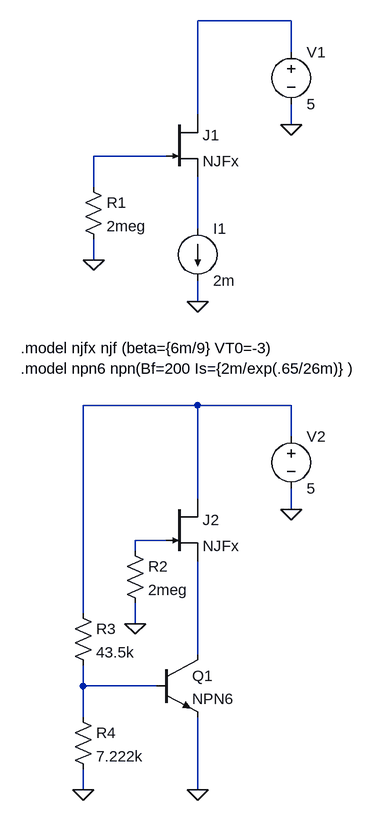
[diagram p0: schematic ws12_13_currentsource.asc]
ws12_13_currentsource.asc, the LTspice schematic file:
Version 4
SHEET 1 884 1060
WIRE 688 -144 544 -144
WIRE 688 -96 688 -144
WIRE 544 0 544 -144
WIRE 688 16 688 -16
WIRE 496 64 384 64
WIRE 384 112 384 64
WIRE 544 176 544 96
WIRE 384 224 384 192
WIRE 544 288 544 256
WIRE 544 448 368 448
WIRE 688 448 544 448
WIRE 688 496 688 448
WIRE 544 592 544 448
WIRE 688 608 688 576
WIRE 496 656 448 656
WIRE 448 672 448 656
WIRE 368 768 368 448
WIRE 448 784 448 752
WIRE 544 832 544 688
WIRE 368 880 368 848
WIRE 480 880 368 880
WIRE 368 928 368 880
WIRE 368 1040 368 1008
WIRE 544 1040 544 928
FLAG 384 224 0
FLAG 544 288 0
FLAG 688 16 0
FLAG 448 784 0
FLAG 688 608 0
FLAG 368 1040 0
FLAG 544 1040 0
SYMBOL voltage 688 -112 R0
WINDOW 123 0 0 Left 2
WINDOW 39 0 0 Left 2
SYMATTR InstName V1
SYMATTR Value 5
SYMBOL current 544 176 R0
WINDOW 123 0 0 Left 2
WINDOW 39 0 0 Left 2
SYMATTR InstName I1
SYMATTR Value 2m
SYMBOL njf 496 0 R0
SYMATTR InstName J1
SYMATTR Value NJFx
SYMBOL res 368 96 R0
SYMATTR InstName R1
SYMATTR Value 2meg
SYMBOL npn 480 832 R0
SYMATTR InstName Q1
SYMATTR Value NPN6
SYMBOL voltage 688 480 R0
WINDOW 123 0 0 Left 2
WINDOW 39 0 0 Left 2
SYMATTR InstName V2
SYMATTR Value 5
SYMBOL njf 496 592 R0
SYMATTR InstName J2
SYMATTR Value NJFx
SYMBOL res 432 656 R0
SYMATTR InstName R2
SYMATTR Value 2meg
SYMBOL res 352 752 R0
SYMATTR InstName R3
SYMATTR Value 43.5k
SYMBOL res 352 912 R0
SYMATTR InstName R4
SYMATTR Value 7.222k
TEXT 272 360 Left 2 !.model njfx njf (beta={6m/9} VT0=-3)\n.model npn6 npn(Bf=200 Is={2m/exp(.65/26m)} )

The netlist it stands for:
* ws12_13_currentsource.asc
V1 N001 0 5
I1 N003 0 2m
J1 N001 N002 N003 NJFx
R1 N002 0 2meg
Q1 N006 N007 0 0 NPN6
V2 N004 0 5
J2 N004 N005 N006 NJFx
R2 N005 0 2meg
R3 N004 N007 43.5k
R4 N007 0 7.222k
.model NPN NPN
.model PNP PNP
.lib standard.bjt
.model NJF NJF
.model PJF PJF
.lib standard.jft
.model njfx njf (beta={6m/9} VT0=-3)
.model npn6 npn(Bf=200 Is={2m/exp(.65/26m)} )
.backanno
.end